# Altium schematic sheet Launchpad_Header.SchDoc
size A; SheetNumber: 1; SheetTotal: 1
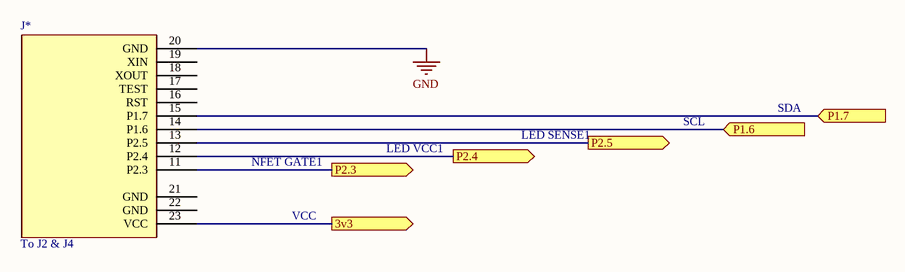
[diagram p0: Launchpad_Header.SchDoc]

## Parts
J*  To J2 & J4  [MSP-EXP430G2 Mating Headers for J2/J4]

## Ports
3v3 (out), P1.6 (in), P1.7 (in), P2.3 (out), P2.4 (out), P2.5 (out)

## Nets
GND: J*.20(GND)
3v3: J*.23(VCC) ; port 3v3
P1.6: J*.14(P1.6) ; port P1.6
P1.7: J*.15(P1.7) ; port P1.7
P2.3: J*.11(P2.3) ; port P2.3
P2.4: J*.12(P2.4) ; port P2.4
P2.5: J*.13(P2.5) ; port P2.5

Not connected (* = marked no-connect by the designer): J* 16(RST) 17(TEST) 18(XOUT) 19(XIN) 21(GND) 22(GND)

## Notes on the sheet
- NFET GATE1
- LED VCC1
- LED SENSE1
- SCL
- SDA
- VCC

## Library data of the parts
J* = MSP-EXP430G2 Mating Headers for J2/J4: Female Mating Headers for MSP-EXP430G2 J2 & J4 / (can use Würth Elektronik 61301011121 and 61300311121); Manufacturer: URC; Manufacturer Part Number: N/A; Value: N/A